# Altium project Li-ion Charger.PrjPcb
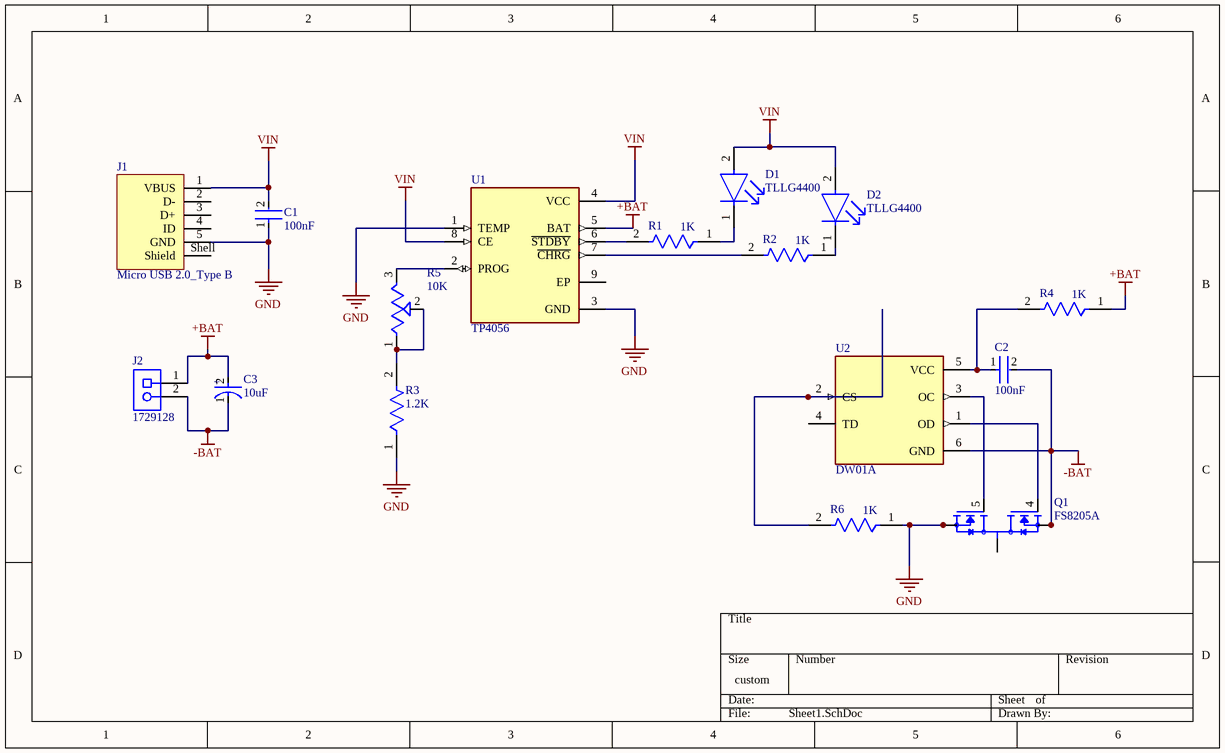
[diagram p0: Sheet1.SchDoc]
Designer: Youssif Hossam; Version: 1.0.0
1 sheet, 16 parts. Net scope: global (net labels, ports and power ports of the same name join across sheets).
Board file: PCB2.PcbDoc

## Sheet Sheet1.SchDoc
size 228 x 139 mm; SheetNumber: 1; SheetTotal: 1

### Parts
C1  100nF  [FP-K15H5-MFG]
C2  100nF  [FP-K15H5-MFG]
C3  10uF  [FP-ECE-A1HN100U-MFG]
D1  TLLG4400  [FP-6_544-5255_01-4-MFG]
D2  TLLG4400  [FP-6_544-5255_01-4-MFG]
J1  Micro USB 2.0_Type B  [Micro USB 2.0_Type B]
J2  1729128  [PHOE-1729128-2_V]
Q1  FS8205A  [SOP65P640X120-8N]
R1  1K  [FP-MRS25-MFG]
R2  1K  [FP-MRS25-MFG]
R3  1.2K  [FP-MRS25-MFG]
R4  1K  [FP-MRS25-MFG]
R5  10K  [TRIM_3318F-1-502]
R6  1K  [FP-MRS25-MFG]
U1  TP4056  [TP4056]
U2  DW01A  [SOT95P280X145-6N]

### Nets
+BAT: C3.2(A) J2.1 R4.1 U1.5(BAT)
-BAT: C2.2 C3.1(C) J2.2 Q1.2(S1) Q1.3(S1) U2.6(GND)
GND: C1.1 J1.5(GND) Q1.6(S2) Q1.7(S2) R3.1 R6.1 U1.1(TEMP) U1.3(GND)
VIN: C1.2 D1.2(A) D2.2(A) J1.1(VBUS) U1.4(VCC) U1.8(CE)
NetC2_1: C2.1 R4.2 U2.5(VCC)
NetD1_1: D1.1(C) R1.1
NetD2_1: D2.1(C) R2.1
NetQ1_1: Q1.1(D12) Q1.8(D12)
NetQ1_4: Q1.4(G1) U2.1(OD)
NetQ1_5: Q1.5(G2) U2.3(OC)
NetR1_2: R1.2 U1.6(~{STDBY})
NetR2_2: R2.2 U1.7(~{CHRG})
NetR3_2: R3.2 R5.1(CCW) R5.2(WIPER)
NetR5_3: R5.3(CW) U1.2(PROG)
NetR6_2: R6.2 U2.2(CS)

Not connected (* = marked no-connect by the designer): J1 2(D-) 3(D+) 4(ID) Shell(Shield); U1 9(EP); U2 4(TD)

### Notes on the sheet
- (in symbol CMP-05427-000036-1) +

### Library data of the parts
C1 C2 = CMP-02417-000078-1: CAP CER 0.1UF 50V X7R RADIAL; Tolerance: 10%; Dielectric Material: Ceramic; Lead Length: 30mm; Lead Diameter: 0.5mm; Lead/Base Style: Formed Leads; Capacitance: 100nF; Diameter: 500um; Max Operating Temperature: 125°C; Case/Package: Dipped; Dielectric: X7R; Lead Free: Lead Free; Construction: RADIAL; Voltage: 50V; Thickness: 2.6mm; Min Operating Temperature: -55°C; Lead Pitch: 5mm; Height: 4mm; Radiation Hardening: No; Voltage Rating: 50V; Depth: 2.5mm; Voltage Rating (DC): 50V; Package Quantity: 1; Weight: 0.005644oz; Series: K; Mount: Through Hole; Termination: Radial; Height - Seated (Max): 0.257inch; Length: 4mm; Packaging: Tape and Reel; Width: 2.5mm; RoHS Compliant: Yes
C3 = CMP-05427-000036-1: CAP ALUM 10UF 20% 50V RADIAL; Leakage Current: 4.5uA; Lead Diameter: 0.5mm; Polarity: Bipolar; Life (Hours): 2000Hour; Dissipation Factor: 0.15%; Ripple Current (AC): 50mA; Dielectric Material: Aluminium; Construction: RADIAL; Contact Plating: Tin; Lead Free: Lead Free; Number of Pins: 2; Height: 11.2mm; Lead Pitch: 2.5mm; Length: 11.2mm; Radiation Hardening: No; Package Quantity: 200; Diameter: 6.3mm; Capacitance: 10uF; Case/Package: Radial; Height - Seated (Max): 0.441inch; Voltage: 50V; Min Operating Temperature: -40°C; Tolerance: 20%; Voltage Rating (DC): 50V; Termination: Radial; Ripple Current: 50mA; Series: SU; REACH SVHC: No SVHC; Packaging: Bulk; Max Operating Temperature: 85°C; Voltage Rating: 50V; RoHS Compliant: Yes; Mount: Through Hole
D1 D2 = CMP-00030-55433990-1: TLLG4400 Led, Pcb, Green, 0.63MCD, 3MM, T-1, 7MA, 1.9V, 565NM, 25DEG, 20V, 20MW, -40; Lens Transparency: Diffused; Dominant Wavelength: 575nm; Test Current: 2mA; Viewing Angle: 50°; Lens Style: Circular, Colored, Diffused, Dome, Round; Number of LEDs: 1; Voltage Rating (DC): 2.4V; Luminous Intensity: 1.2mcd; Depth: 3.2mm; Wavelength: 575nm; Color: Green; Schedule B: 8541402000, 8541402000; RoHS: Compliant; Max Operating Temperature: 100°C; Power Dissipation: 20mW; Height: 4.5mm; Number of Pins: 2; Forward Voltage: 1.9V; NexarPartId: 55433990; Max Power Dissipation: 20mW; Length: 3.2mm; Forward Current: 2mA; Min Operating Temperature: -40°C; Illumination Color: Green; Lens Size: 3mm; Reverse Voltage: 20V; Mount: Through Hole; Case/Package: T; Radiation Hardening: No; Number of Elements: 1; REACH SVHC: Unknown; Lens Color: Green
J1 = Micro USB 2.0_Type B: NexarPartId: 52645113; Number of Contacts: 5; Contact Resistance: 30mΩ; Voltage Rating: 30V; Current Rating: 3A; USB Standard: USB 2.0; Gender: Receptacle; Insulation Resistance: 1GΩ; Height: 2.86mm; REACH SVHC: Unknown; Connector Type: USB; RoHS: Compliant; Features: Shielded; Termination: SMD/SMT; Number of Pins: 5; Contact Plating: Gold; Packaging: Tape and Reel; Contact Material: Gold; Mount: Horizontal, Surface Mount; Max Operating Temperature: 85°C; Lead Free: Lead Free; Min Operating Temperature: -40°C; Orientation: Horizontal; Operating Supply Voltage: 30V
J2 = CMP-2000-05815-1: PCB Terminal Block, 13.5 A, 400 V, 2-Pin THD, RoHS, Bulk; Manufacturer: Phoenix Contact; Package Version: 03/2015; No. of Rows: 1; Pitch: 5.08mm; No. of Positions: 2; Voltage Rating: 400V; Current Rating: 13500mA; Manufacturer URL: http://www.phoenixcontact.com/; Datasheet URL: https://datasheet.ciiva.com/16046/1729128-16046181.pdf; RoHS: TRUE; Package URL: https://www.phoenixcontact.com/online/portal/pi/pxc/product_detail_page/!ut/p/b1/3VdJjqNKFDxLH8AFycySyWY2ozFsEPOMMQaDOX1XedGL_1Vdm5YXJleknhSKeBkvI6EA8ncAo3AYoDhBQGco6KN7VURTdemj9us_IEKEZo_YHiPAEWEFmDGOHMORkqKYCORBZxgL7ZoaZYcbFFUZ3fqxSY6GOuxydWUuHqz1ynmMFygu583Bob0Ewr6Sd_l-5m-kAueHiB0jpRwZwe58wwtkpxtMYd_LmGcDRU02dRNEyWt6Y2ti5pSyJ_reIkzIulrqApdnbT11V5jnCKbYNCvhEM1MCpPByat_X379-iThf08CI5GfOPqfBeS3BRoBOdD55AKVv0iLwCMq-2BrzXWSGRH7pUGD9uwXQjiph3xL0DKQwdGa0JImiIOmBNOestqgwTHSSs2oOep-78apyXQBvNi8ZLaFjvjWvcaUEBu0MC6Wbe-d6mB0FAebo2lUWinqYaZs5DAYzV0RP9yitUjnGJ0iI9xhZkT42OCQNUJJhkgWINNQLP2JFP6OpMg3JCVg70jqHT0lvKOnhHf0lPuOnnLf0VPuWx6_dxwUIvwk5WMkT0kLL1mh61l2yZVSzG3pYV_bqo-mj6uMKwKwdnnW8Jh5RTOJzMOA5c-eJDaZQw4mTMPH02PvS_ZAqNVjVTo2WyYLkwH_KU1mmmG5kjRhDqPXLwwVHvVOjCM60-fpXvTDfMGW1PVFVS1r4e4yVDk4ZdNbkUHvqPqQSeian4UD39fNKmachqdJ1NJbyk8rXT9mXTvPk3oE5meulKGgiruPJek-4I9hTT6G8ZLOyRSm2RRVbThERQad5OS28hdt4YW4vG0stgYYzsWsK4_7y6DZMjJSCqri1kyiZR5vD7pwIrNR7QwPHTcLTI5qT7eRlpHrdGiupYlqQDJ7zy_CND8fWWBoLRXxk1RVcXiBQwbTD4Xi7KL-FuO94t9xaqweXzH; PartNumber: 1729128; Package Description: 2-Pin Through Hole Device, Body 8.1 x 10.16 mm, Pitch 5.08 mm; Datasheet Version: 12/2013; Mounting Technology: ThroughHole; Orientation: Horizontal; Package Reference: 1729128-2; Packing: Bulk
Q1 = FS8205A: N/A; MF: Fortune Semiconductor; MP: FS8205A; Value: *; Availability: Not in stock; Package: Package; Price: None; SnapEDA_Link: https://www.snapeda.com/parts/FS8205A/Fortune+Semiconductor/view-part/?ref=snap; Check_prices: https://www.snapeda.com/parts/FS8205A/Fortune+Semiconductor/view-part/?ref=eda
R1-R4 R6 = CMP-02408-000051-1: RES 1K OHM 0.6W 1% AXIAL; Power Rating: 600mW; Lead Diameter: 0.6mm; Voltage Rating (DC): 350V; Resistance: 1kR; Temperature Coefficient: 50ppm/°C; Width: 2.5mm; Military Standard: Not; Package Quantity: 5000; Radiation Hardening: No; Case/Package: Axial; Resistance Tolerance: 1%; Resistor Type: Metal Film; Contact Plating: Tin; Length: 6.5mm; Lead Free: Lead Free; RoHS Compliant: Yes; Mount: Through Hole; Number of Pins: 2; Technology: THIN FILM; Voltage Rating: 350V; Min Operating Temperature: -55°C; Weight: 0.00776oz; Diameter: 2.5mm; Construction: Cylindrical; Series: MRS25; Tolerance: 1%; Packaging: Tape and Reel; Max Operating Temperature: 155°C; Max Power Dissipation: 600mW; Number of Terminations: 2; Termination: Axial
R5 = Carbon Trimmer: 5 kOhms 0.1W, 1/10W PC Pins Through Hole Trimmer Potentiometer Carbon 1.0 Turn Top Adjustment; MP: 3318F-1-502; MF: Bourns Inc.; Value: *; SnapEDA_Link: https://www.snapeda.com/parts/3318F-1-502/Bourns/view-part/?ref=snap; Purchase-URL: https://pricing.snapeda.com/search/part/3318F-1-502/?ref=eda; Check_prices: https://www.snapeda.com/parts/3318F-1-502/Bourns/view-part/?ref=eda; Availability: In Stock; Price: None; Package: SMD-3 Bourns
U1 = TP4056: Complete single cell Li-Ion battery with a constant current / constant voltage linear charger; MF: NanJing Top Power ASIC Corp.; Check_prices: https://www.snapeda.com/parts/TP4056/NanJing+Top+Power+ASIC+Corp./view-part/?ref=eda; SnapEDA_Link: https://www.snapeda.com/parts/TP4056/NanJing+Top+Power+ASIC+Corp./view-part/?ref=snap; Price: None; Availability: Not in stock; Package: Package; MP: TP4056; Value: *
U2 = DW01A: One Cell Lithium-ion/Polymer Battery Protection IC; MF: Fortune Semiconductor; SnapEDA_Link: https://www.snapeda.com/parts/DW01A/Fortune+Semiconductor/view-part/?ref=snap; Package: SOT-23-6 Fortune Semiconductor; Value: *; MP: DW01A; Check_prices: https://www.snapeda.com/parts/DW01A/Fortune+Semiconductor/view-part/?ref=eda